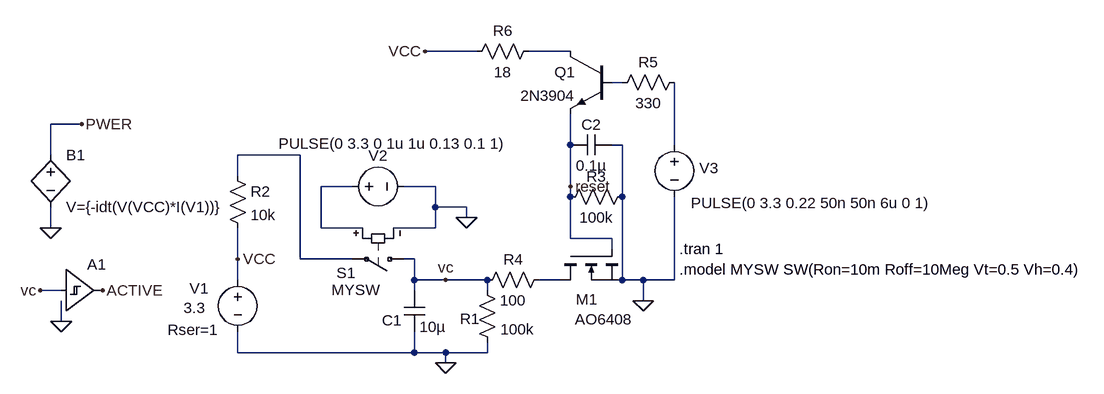
[diagram p0: schematic Power Timing.asc]
Power Timing.asc, the LTspice schematic file:
Version 4
SHEET 1 1056 680
WIRE 112 -240 32 -240
WIRE 256 -240 192 -240
WIRE 336 -192 320 -192
WIRE -496 -128 -544 -128
WIRE 256 -96 256 -144
WIRE 336 -96 320 -96
WIRE 416 -96 416 -192
WIRE -544 -80 -544 -128
WIRE -160 -80 -256 -80
WIRE -256 -48 -256 -80
WIRE -80 -32 -128 -32
WIRE 48 -32 0 -32
WIRE 256 -32 256 -96
WIRE 256 -16 256 -32
WIRE 336 -16 336 -96
WIRE 48 0 48 -32
WIRE 96 0 48 0
WIRE 96 16 96 0
WIRE -544 32 -544 0
WIRE -128 32 -128 -32
WIRE -64 32 -128 32
WIRE 48 32 48 0
WIRE 48 32 -16 32
WIRE 256 48 256 -16
WIRE 320 48 256 48
WIRE 320 64 320 48
WIRE -256 80 -256 32
WIRE -160 80 -160 -80
WIRE -80 80 -160 80
WIRE 16 80 0 80
WIRE -256 112 -256 80
WIRE 16 112 16 80
WIRE 64 112 16 112
WIRE 128 112 64 112
WIRE 240 112 208 112
WIRE 336 112 336 -16
WIRE 368 112 336 112
WIRE 416 112 416 -16
WIRE 416 112 368 112
WIRE -528 128 -560 128
WIRE 16 128 16 112
WIRE 128 128 128 112
WIRE 368 144 368 112
WIRE -528 176 -528 144
WIRE -256 224 -256 192
WIRE 16 224 16 192
WIRE 16 224 -256 224
WIRE 64 224 16 224
WIRE 128 224 128 208
WIRE 128 224 64 224
WIRE 64 240 64 224
FLAG 64 240 0
FLAG 64 112 vc
FLAG 96 16 0
FLAG 368 144 0
FLAG 256 -32 reset
FLAG -544 32 0
FLAG -496 -128 PWER
FLAG -256 80 VCC
FLAG -560 128 vc
FLAG 32 -240 VCC
FLAG -528 176 0
FLAG -464 128 ACTIVE
SYMBOL cap 0 128 R0
WINDOW 0 -34 46 Left 2
SYMATTR InstName C1
SYMATTR Value 10µ
SYMBOL res 112 112 R0
WINDOW 0 -26 60 Left 2
SYMATTR InstName R1
SYMATTR Value 100k
SYMBOL voltage -256 96 R0
WINDOW 0 -74 29 Left 2
WINDOW 3 -83 59 Left 2
WINDOW 123 0 0 Left 0
WINDOW 39 -108 93 Left 2
SYMATTR InstName V1
SYMATTR Value 3.3
SYMATTR SpiceLine Rser=1
SYMBOL sw 16 80 R90
WINDOW 0 21 91 VRight 2
WINDOW 3 47 53 VRight 2
SYMATTR InstName S1
SYMATTR Value MYSW
SYMBOL voltage -96 -32 R270
WINDOW 0 32 56 VTop 2
WINDOW 3 82 78 VBottom 2
WINDOW 123 0 0 Left 0
WINDOW 39 0 0 Left 0
SYMATTR InstName V2
SYMATTR Value PULSE(0 3.3 0 1u 1u 0.13 0.1 1)
SYMBOL res -272 -64 R0
SYMATTR InstName R2
SYMATTR Value 10k
SYMBOL res 352 -32 R90
WINDOW 0 0 56 VBottom 2
WINDOW 3 32 56 VTop 2
SYMATTR InstName R3
SYMATTR Value 100k
SYMBOL cap 320 -112 R90
WINDOW 0 0 32 VBottom 2
WINDOW 3 32 32 VTop 2
SYMATTR InstName C2
SYMATTR Value 0.1µ
SYMBOL voltage 416 -112 R0
WINDOW 0 53 36 Top 2
WINDOW 3 211 121 Bottom 2
WINDOW 123 0 0 Left 0
WINDOW 39 78 68 Top 2
SYMATTR InstName V3
SYMATTR Value PULSE(0 3.3 0.22 50n 50n 6u 0 1)
SYMBOL res 224 96 R90
WINDOW 0 0 56 VBottom 2
WINDOW 3 32 56 VTop 2
SYMATTR InstName R4
SYMATTR Value 100
SYMBOL nmos 240 64 M90
WINDOW 3 109 23 VRight 2
WINDOW 0 78 58 VLeft 2
SYMATTR Value AO6408
SYMATTR InstName M1
SYMBOL bv -544 -96 R0
SYMATTR InstName B1
SYMATTR Value V={-idt(V(VCC)*I(V1))}
SYMBOL Digital\\schmtbuf -528 64 R0
WINDOW 3 0 0 Invisible 0
SYMATTR Value Vhigh=3.3 Vt=1.5 Vh=0.65
SYMATTR InstName A1
SYMBOL res 432 -208 R90
WINDOW 0 0 56 VBottom 2
WINDOW 3 32 56 VTop 2
SYMATTR InstName R5
SYMATTR Value 330
SYMBOL npn 320 -240 M0
SYMATTR InstName Q1
SYMATTR Value 2N3904
SYMBOL res 208 -256 R90
WINDOW 0 0 56 VBottom 2
WINDOW 3 32 56 VTop 2
SYMATTR InstName R6
SYMATTR Value 18
TEXT 424 64 Left 2 !.tran 1
TEXT 424 96 Left 2 !.model MYSW SW(Ron=10m Roff=10Meg Vt=0.5 Vh=0.4)

The netlist it stands for:
* Power Timing.asc
C1 vc 0 10µ
R1 vc 0 100k
V1 VCC 0 3.3 Rser=1
S1 vc N004 N005 0 MYSW
V2 N005 0 PULSE(0 3.3 0 1u 1u 0.13 0.1 1)
R2 N004 VCC 10k
R3 0 reset 100k
C2 0 reset 0.1µ
V3 N003 0 PULSE(0 3.3 0.22 50n 50n 6u 0 1)
R4 N006 vc 100
M1 N006 reset 0 0 AO6408
B1 PWER 0 V={-idt(V(VCC)*I(V1))}
A1 vc 0 0 0 0 0 ACTIVE 0 SCHMITT Vhigh=3.3 Vt=1.5 Vh=0.65
R5 N003 N002 330
Q1 N001 N002 reset 0 2N3904
R6 N001 VCC 18
.model NPN NPN
.model PNP PNP
.lib standard.bjt
.model NMOS NMOS
.model PMOS PMOS
.lib standard.mos
.tran 1
.model MYSW SW(Ron=10m Roff=10Meg Vt=0.5 Vh=0.4)
.backanno
.end